# Altium schematic sheet PMPi-PCB.SchDoc
size A; SheetNumber: 2; SheetTotal: 7
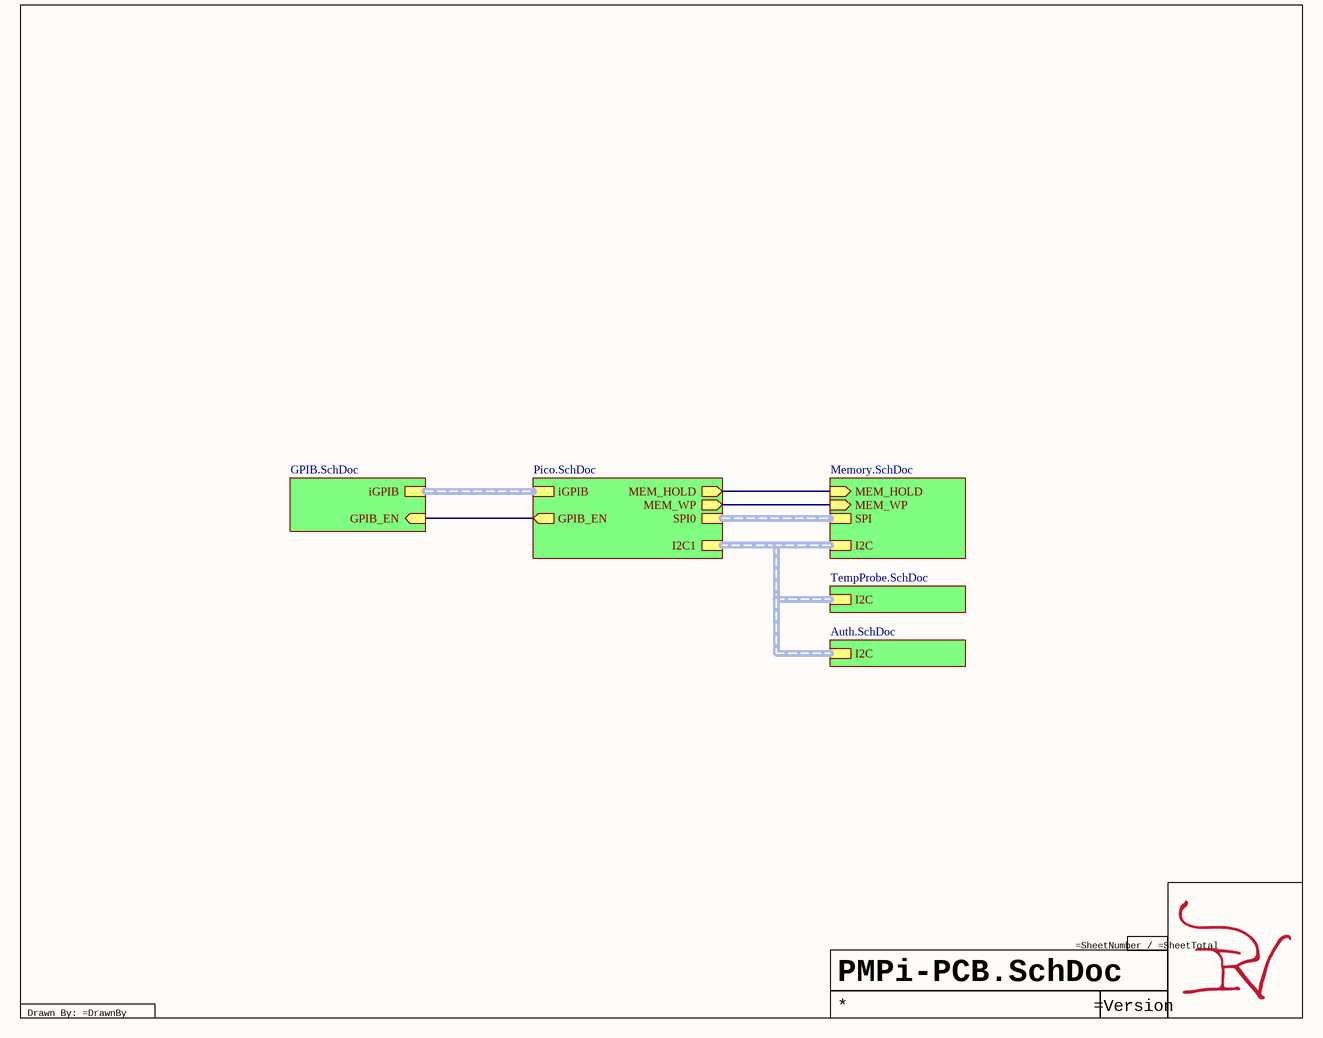
[diagram p0: PMPi-PCB.SchDoc]

## Sub-sheets
U_Auth = Auth.SchDoc: I2C (harness I2C)
U_EEPROM = Memory.SchDoc: MEM_HOLD (in), SPI (harness SPI), I2C (harness I2C), MEM_WP (in)
U_GPIB = GPIB.SchDoc: iGPIB (harness iGPIB), GPIB_EN (in)
U_Pico = Pico.SchDoc: iGPIB (harness iGPIB), SPI0 (harness SPI), MEM_HOLD (out), I2C1 (harness I2C), GPIB_EN (out), MEM_WP (out)
U_TempProbe = TempProbe.SchDoc: I2C (harness I2C)

## Nets
(unnamed): sheet U_GPIB/GPIB_EN, sheet U_Pico/GPIB_EN
(unnamed): sheet U_Pico/MEM_HOLD, sheet U_EEPROM/MEM_HOLD
(unnamed): sheet U_Pico/MEM_WP, sheet U_EEPROM/MEM_WP

## Buses and harness runs
harness sheet U_Auth/I2C = sheet U_EEPROM/I2C = sheet U_Pico/I2C1 = sheet U_TempProbe/I2C
harness sheet U_EEPROM/SPI = sheet U_Pico/SPI0
harness sheet U_GPIB/iGPIB = sheet U_Pico/iGPIB

## Notes on the sheet
- Drawn By: =DrawnBy